# Altium schematic sheet Servos.SchDoc
size A4
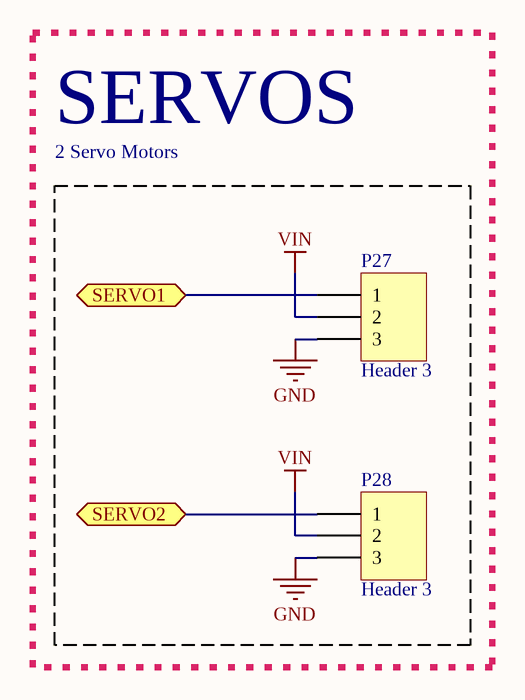
[diagram p0: Servos.SchDoc]

## Parts
P27  Header 3  [HDR1X3]
P28  Header 3  [HDR1X3]

## Blocks framed on the sheet
2 Servo Motors: P27 P28

## Ports
SERVO1, SERVO2

## Nets
GND: P27.3 P28.3
VIN: P27.2 P28.2
SERVO1: P27.1 ; port SERVO1
SERVO2: P28.1 ; port SERVO2

## Notes on the sheet
- SERVOS

## Library data of the parts
P27 P28 = Header 3: Header, 3-Pin; LatestRevisionDate: 17-Jul-2002; LatestRevisionNote: Re-released for DXP Platform.; Publisher: Altium Limited